# EAGLE design Trabalho_3 (EAGLE 9.6.2)
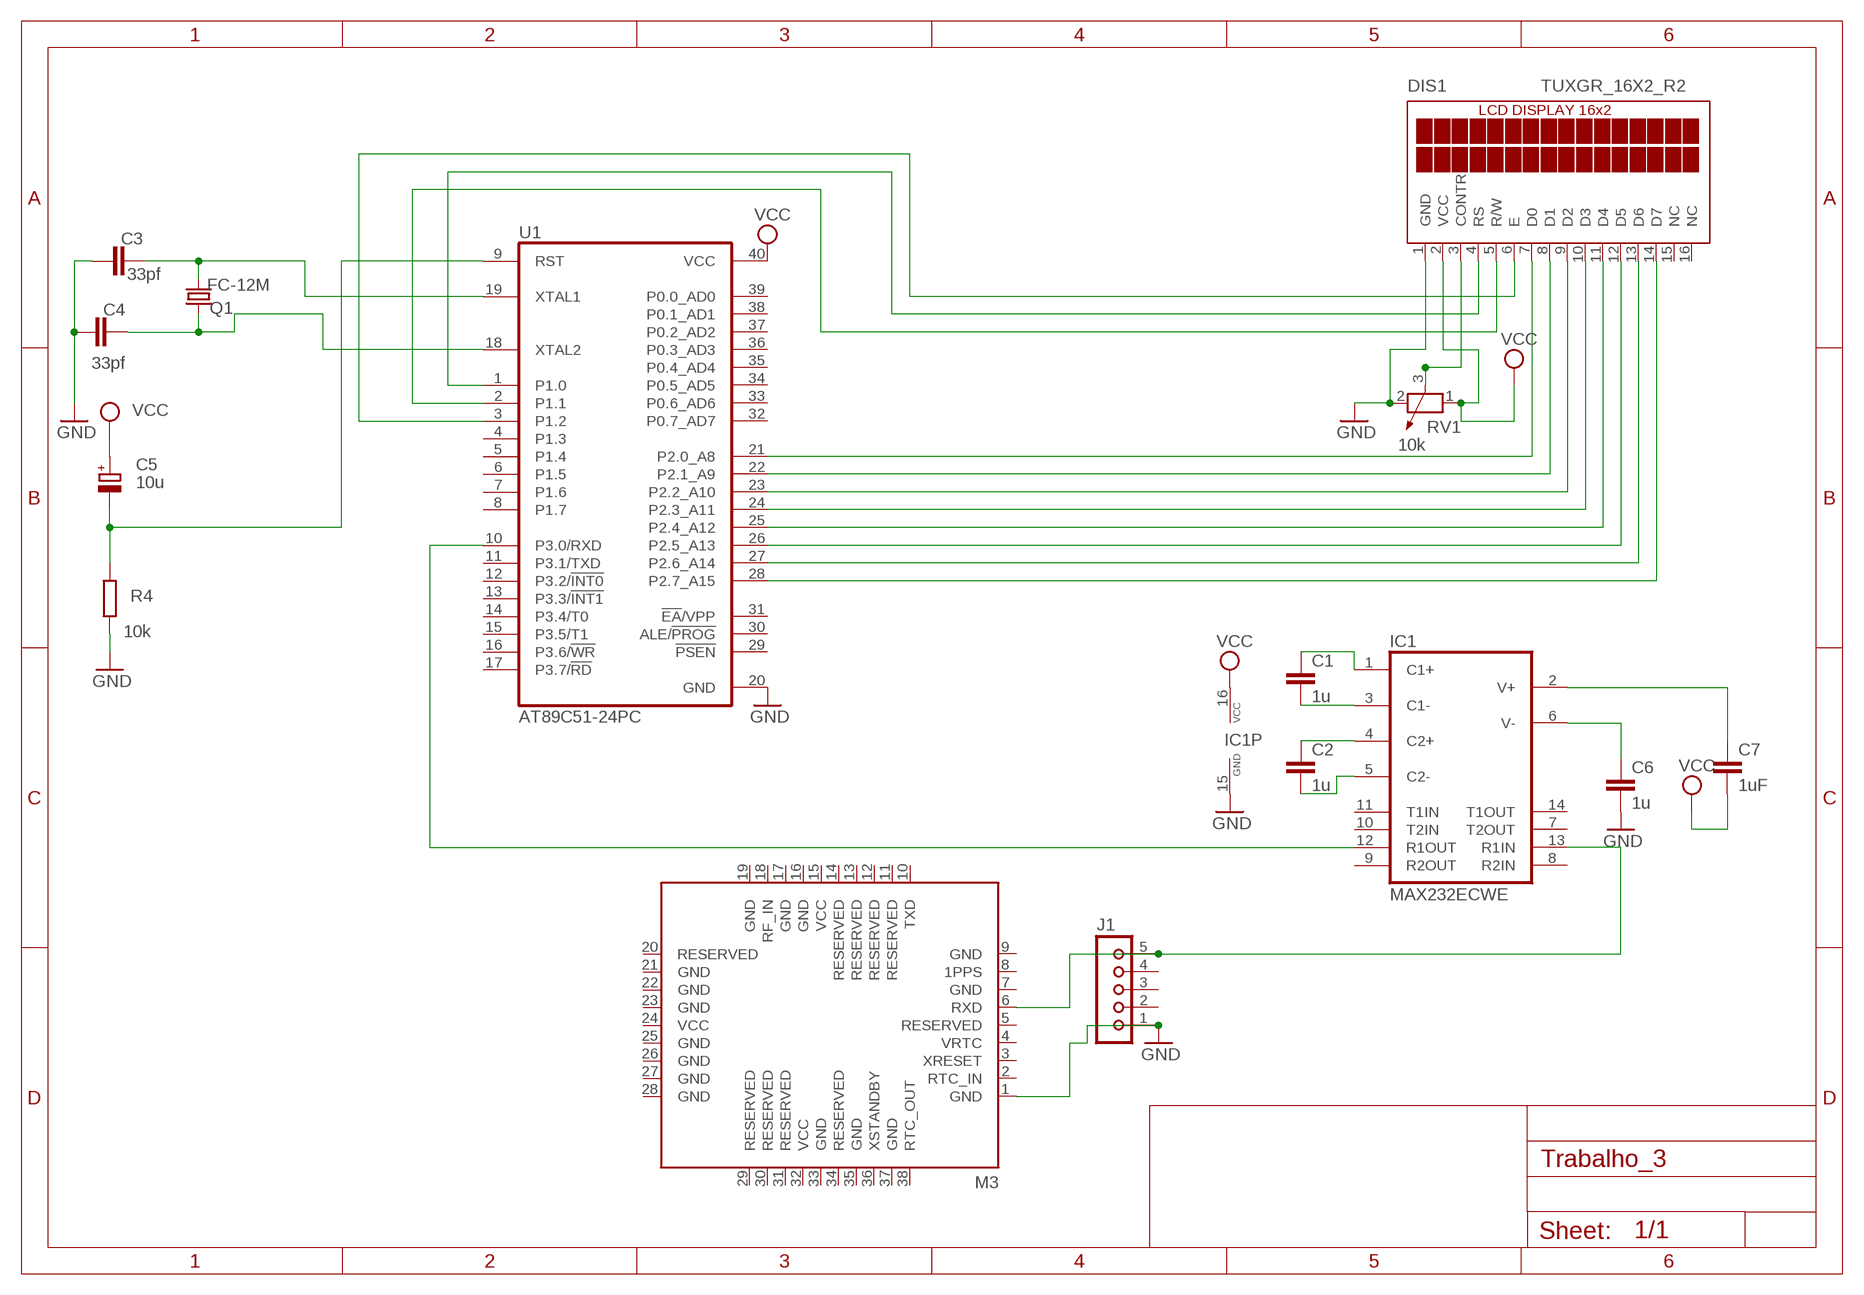
[diagram p0: schematic, sheet 1]

## Parts
C1  1u  C-EU025-025X050  [C025-025X050]
C2  1u  C-EU025-025X050  [C025-025X050]
C3  33pf  C-EU025-025X050  [C025-025X050]
C4  33pf  C-EU025-025X050  [C025-025X050]
C5  10u  CPOL-EUE2,5-6E  [E2,5-6E]
C6  1u  C-EUC0805  [C0805]
C7  1uF  C-EUC0805  [C0805]
DIS1  TUXGR_16X2_R2  [TUXGR_16X2_R2]
IC1  MAX232ECWE  [SO16L]
J1  JU05  [JU05]
M3  C1011_CONDOR-SMD  [1011]
Q1  FC-12M  [FC-12M]
R4  10k  R-EU_0204/7  [0204/7]
RV1  10k  POTENTIOMETER_PT-10  [PT-10]
U1  AT89C51-24PC  [DIL40]

## Nets
GND: C3.1 C4.1 C6.2 DIS1.1(GND) IC1.15(GND) J1.1 M3.1(GND) R4.1 RV1.2 U1.20(GND)
N$1: DIS1.3(CONTR) RV1.3
N$2: DIS1.4(RS) U1.1(P1.0)
N$3: DIS1.5(R/W) U1.2(P1.1)
N$4: DIS1.6(E) U1.3(P1.2)
N$5: DIS1.7(D0) U1.21(P2.0_A8)
N$6: DIS1.8(D1) U1.22(P2.1_A9)
N$7: DIS1.9(D2) U1.23(P2.2_A10)
N$8: DIS1.10(D3) U1.24(P2.3_A11)
N$9: DIS1.11(D4) U1.25(P2.4_A12)
N$10: DIS1.12(D5) U1.26(P2.5_A13)
N$11: DIS1.13(D6) U1.27(P2.6_A14)
N$12: DIS1.14(D7) U1.28(P2.7_A15)
N$13: C3.2 Q1.2 U1.19(XTAL1)
N$14: C5.- R4.2 U1.9(RST)
N$15: C4.2 Q1.1 U1.18(XTAL2)
N$16: IC1.12(R1OUT) U1.10(P3.0/RXD)
N$17: C1.1 IC1.1(C1+)
N$18: C1.2 IC1.3(C1-)
N$19: C2.1 IC1.4(C2+)
N$20: C2.2 IC1.5(C2-)
N$21: C6.1 IC1.6(V-)
N$22: C7.1 IC1.2(V+)
N$24: IC1.13(R1IN) J1.5 M3.6(RXD)
VCC: C5.+ C7.2 DIS1.2(VCC) IC1.16(VCC) RV1.1 U1.40(VCC)
Unconnected: DIS1.15(NC) DIS1.16(NC) IC1.7(T2OUT) IC1.8(R2IN) IC1.9(R2OUT) IC1.10(T2IN) IC1.11(T1IN) IC1.14(T1OUT) J1.2 J1.3 J1.4 M3.2(RTC_IN) M3.3(XRESET) M3.4(VRTC) M3.5(RESERVED) M3.8(1PPS) M3.10(TXD) M3.11(RESERVED) M3.12(RESERVED) M3.13(RESERVED) M3.14(RESERVED) M3.18(RF_IN) M3.20(RESERVED) M3.29(RESERVED) M3.30(RESERVED) M3.31(RESERVED) M3.34(RESERVED) M3.36(XSTANDBY) M3.38(RTC_OUT) U1.4(P1.3) U1.5(P1.4) U1.6(P1.5) U1.7(P1.6) U1.8(P1.7) U1.11(P3.1/TXD) U1.12(P3.2/!INT0) U1.13(P3.3/!INT1) U1.14(P3.4/T0) U1.15(P3.5/T1) U1.16(P3.6/!WR) U1.17(P3.7/!RD) U1.29(!PSEN) U1.30(ALE/!PROG) U1.31(!EA!/VPP) U1.32(P0.7_AD7) U1.33(P0.6_AD6) U1.34(P0.5_AD5) U1.35(P0.4_AD4) U1.36(P0.3_AD3) U1.37(P0.2_AD2) U1.38(P0.1_AD1) U1.39(P0.0_AD0)

## Power pins joined to a net without a drawn wire
GND: M3.7(GND) M3.9(GND) M3.16(GND) M3.17(GND) M3.19(GND) M3.21(GND) M3.22(GND) M3.23(GND) M3.25(GND) M3.26(GND) M3.27(GND) M3.28(GND) M3.33(GND) M3.35(GND) M3.37(GND)
VCC: M3.15(VCC) M3.24(VCC) M3.32(VCC)

## Library data of the parts
C1-C4 C6 C7 = rcl:C-EU: CAPACITOR, European symbol; SPICEPREFIX: C
C5 = rcl:CPOL-EU: POLARIZED CAPACITOR, European symbol; SPICEPREFIX: C
DIS1 = display-lcd:TUXGR_16X2_R2: Tuxgraphics LCD display 16x2 characters reflective, without background light Source: tuxgr_12x2_r2.pdf; OC_FARNELL: unknown; OC_NEWARK: unknown
IC1 = maxim:MAX232ECWE: RS232 TRANSCEIVER; MF: MAXIM; MPN: MAX232ECWE+; OC_FARNELL: 9724435; OC_NEWARK: 67K4440
J1 = con-lsta:JU05: PIN HEADER; OC_FARNELL: unknown; OC_NEWARK: unknown
M3 = trimble:C1011_CONDOR: Condor C1011 GPS Receiver Module SMD GPS Receiver module, made by Trimble Navigation Ltd, Embedded Systems Group <http://www.trimble.com/embeddedsystems/> Partnumber: 68674-00 Datasheet, User Manual and Tools <http://www.trimble.com/embeddedsystems/condor-gps-module.aspx> Created by Trimble Navigation Ltd, Author: Christian Voit <mailto:christian_voit@trimble.com?subject=Trimble Eagle Library>
Q1 = crystal:FC-12M: kHz RANGE CRYSTAL UNIT LOW PROFILE SMD Source: Epson Toyocom FC-12M.pdf
R4 = rcl:R-EU_: RESISTOR, European symbol; SPICEPREFIX: R
RV1 = rcl:POTENTIOMETER_: Potentiometer; SPICEMODEL: POT; SPICEPREFIX: X
U1 = atmel:AT89C51-*: 8-bit Microcontroller with 4K Bytes Flash Not Recommended for New Designs. Use AT89S51. Source: http://www.atmel.com/dyn/resources/prod_documents/doc0265.; OC_FARNELL: unknown; OC_NEWARK: unknown

## Board
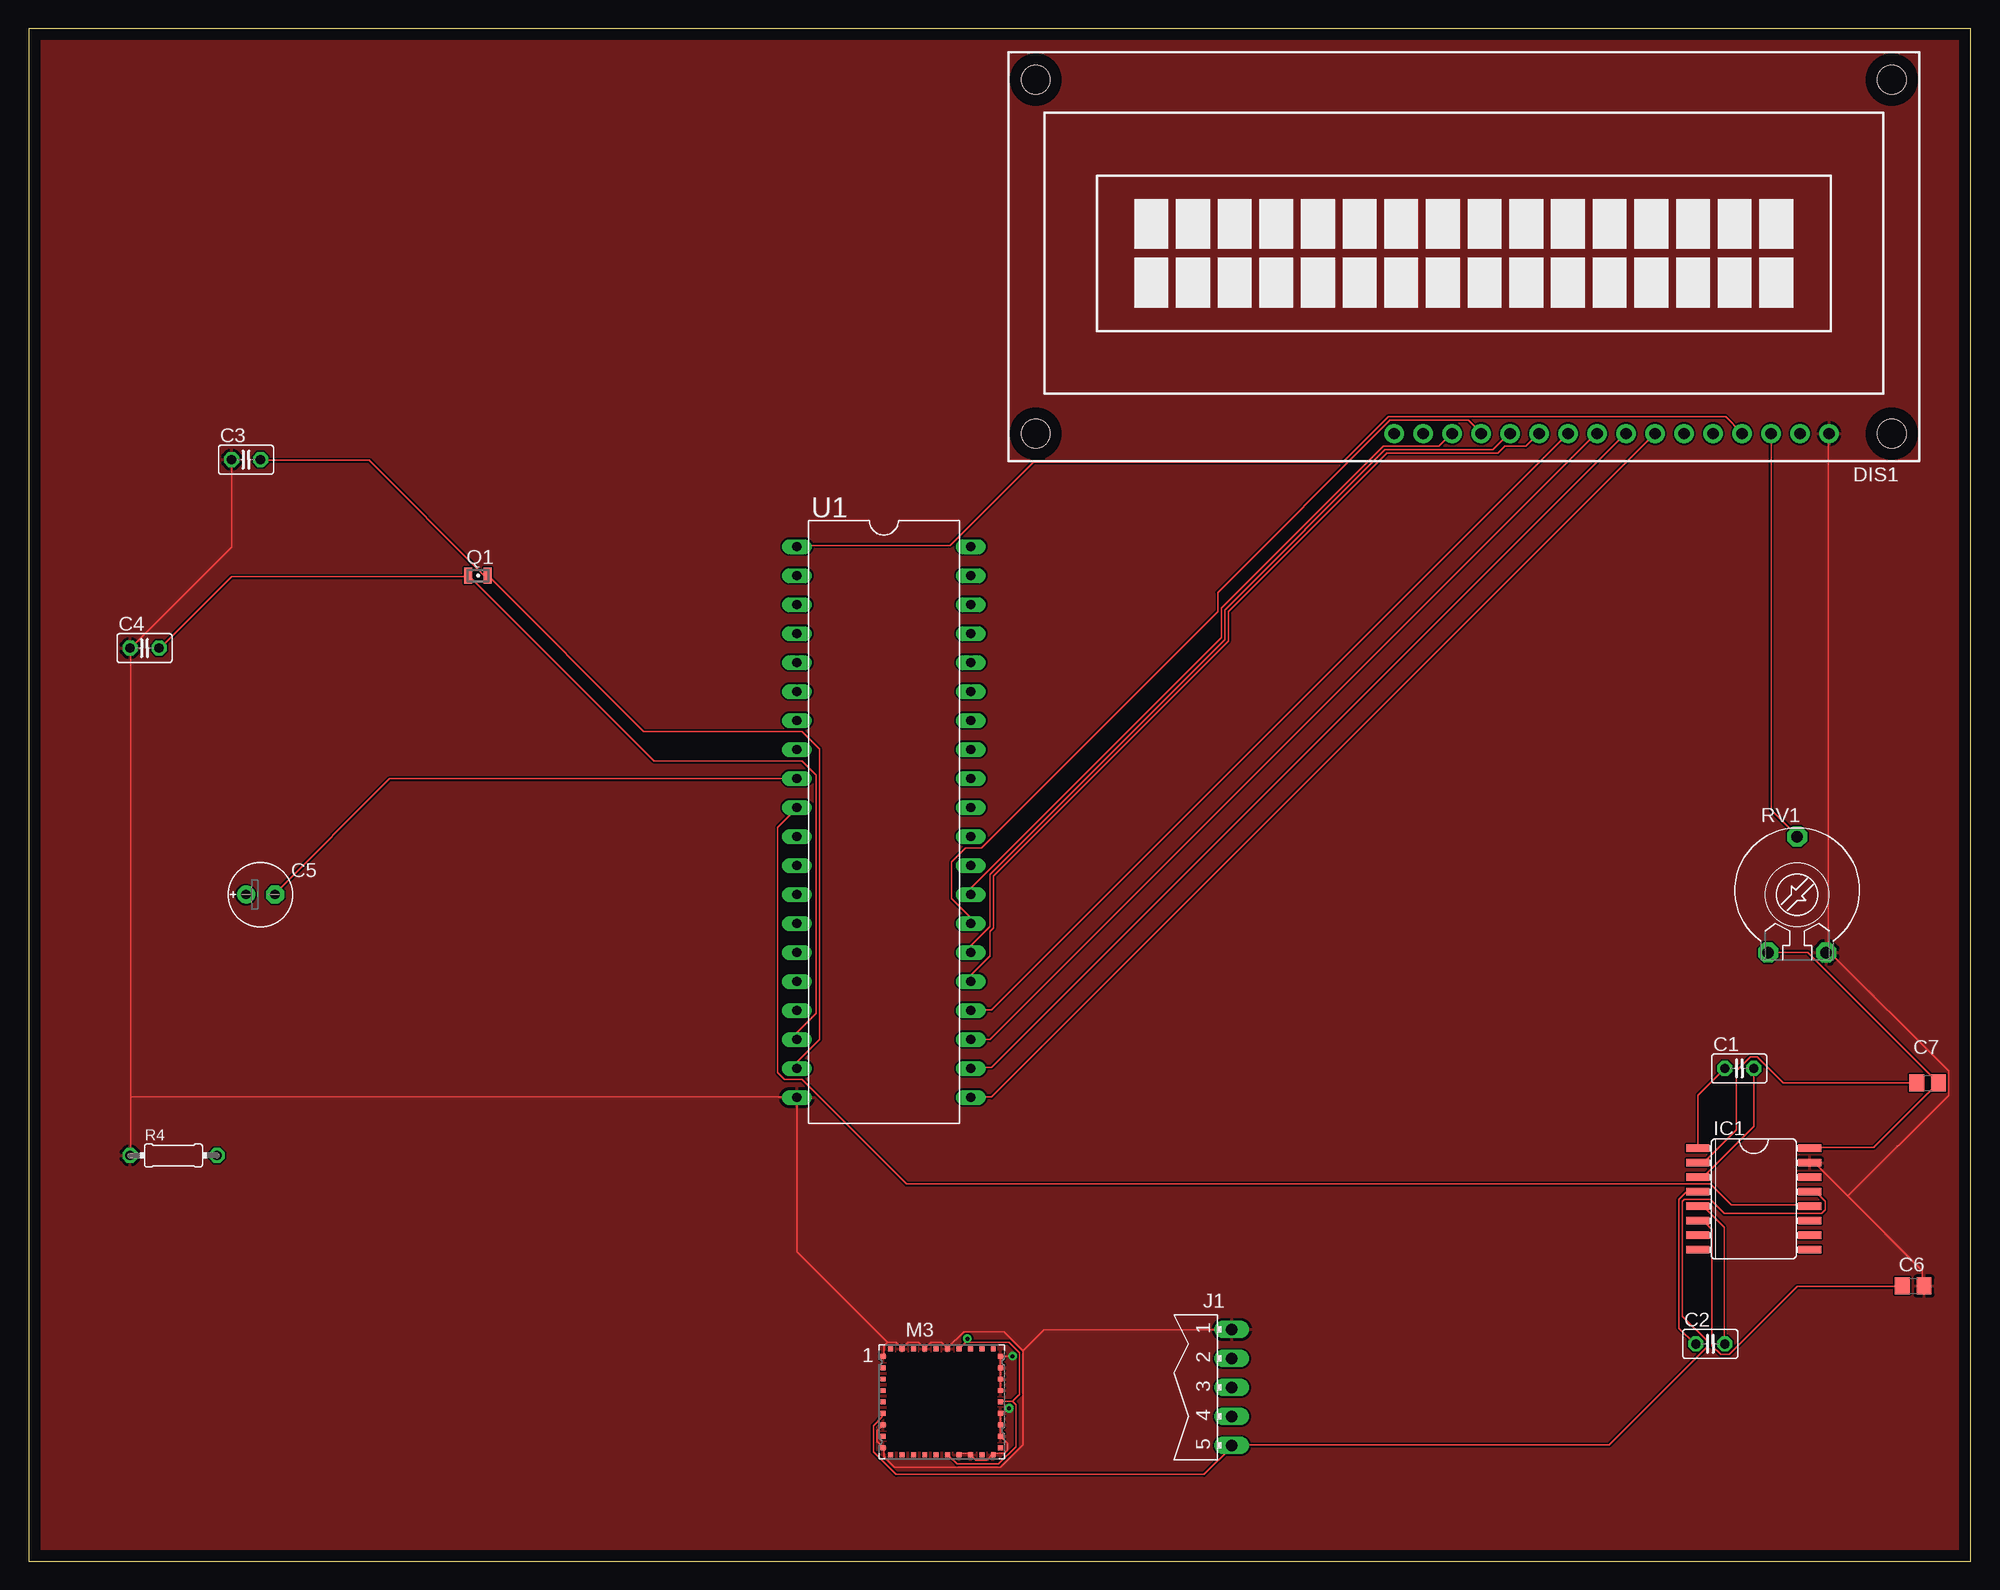
[diagram p1: board, top side]
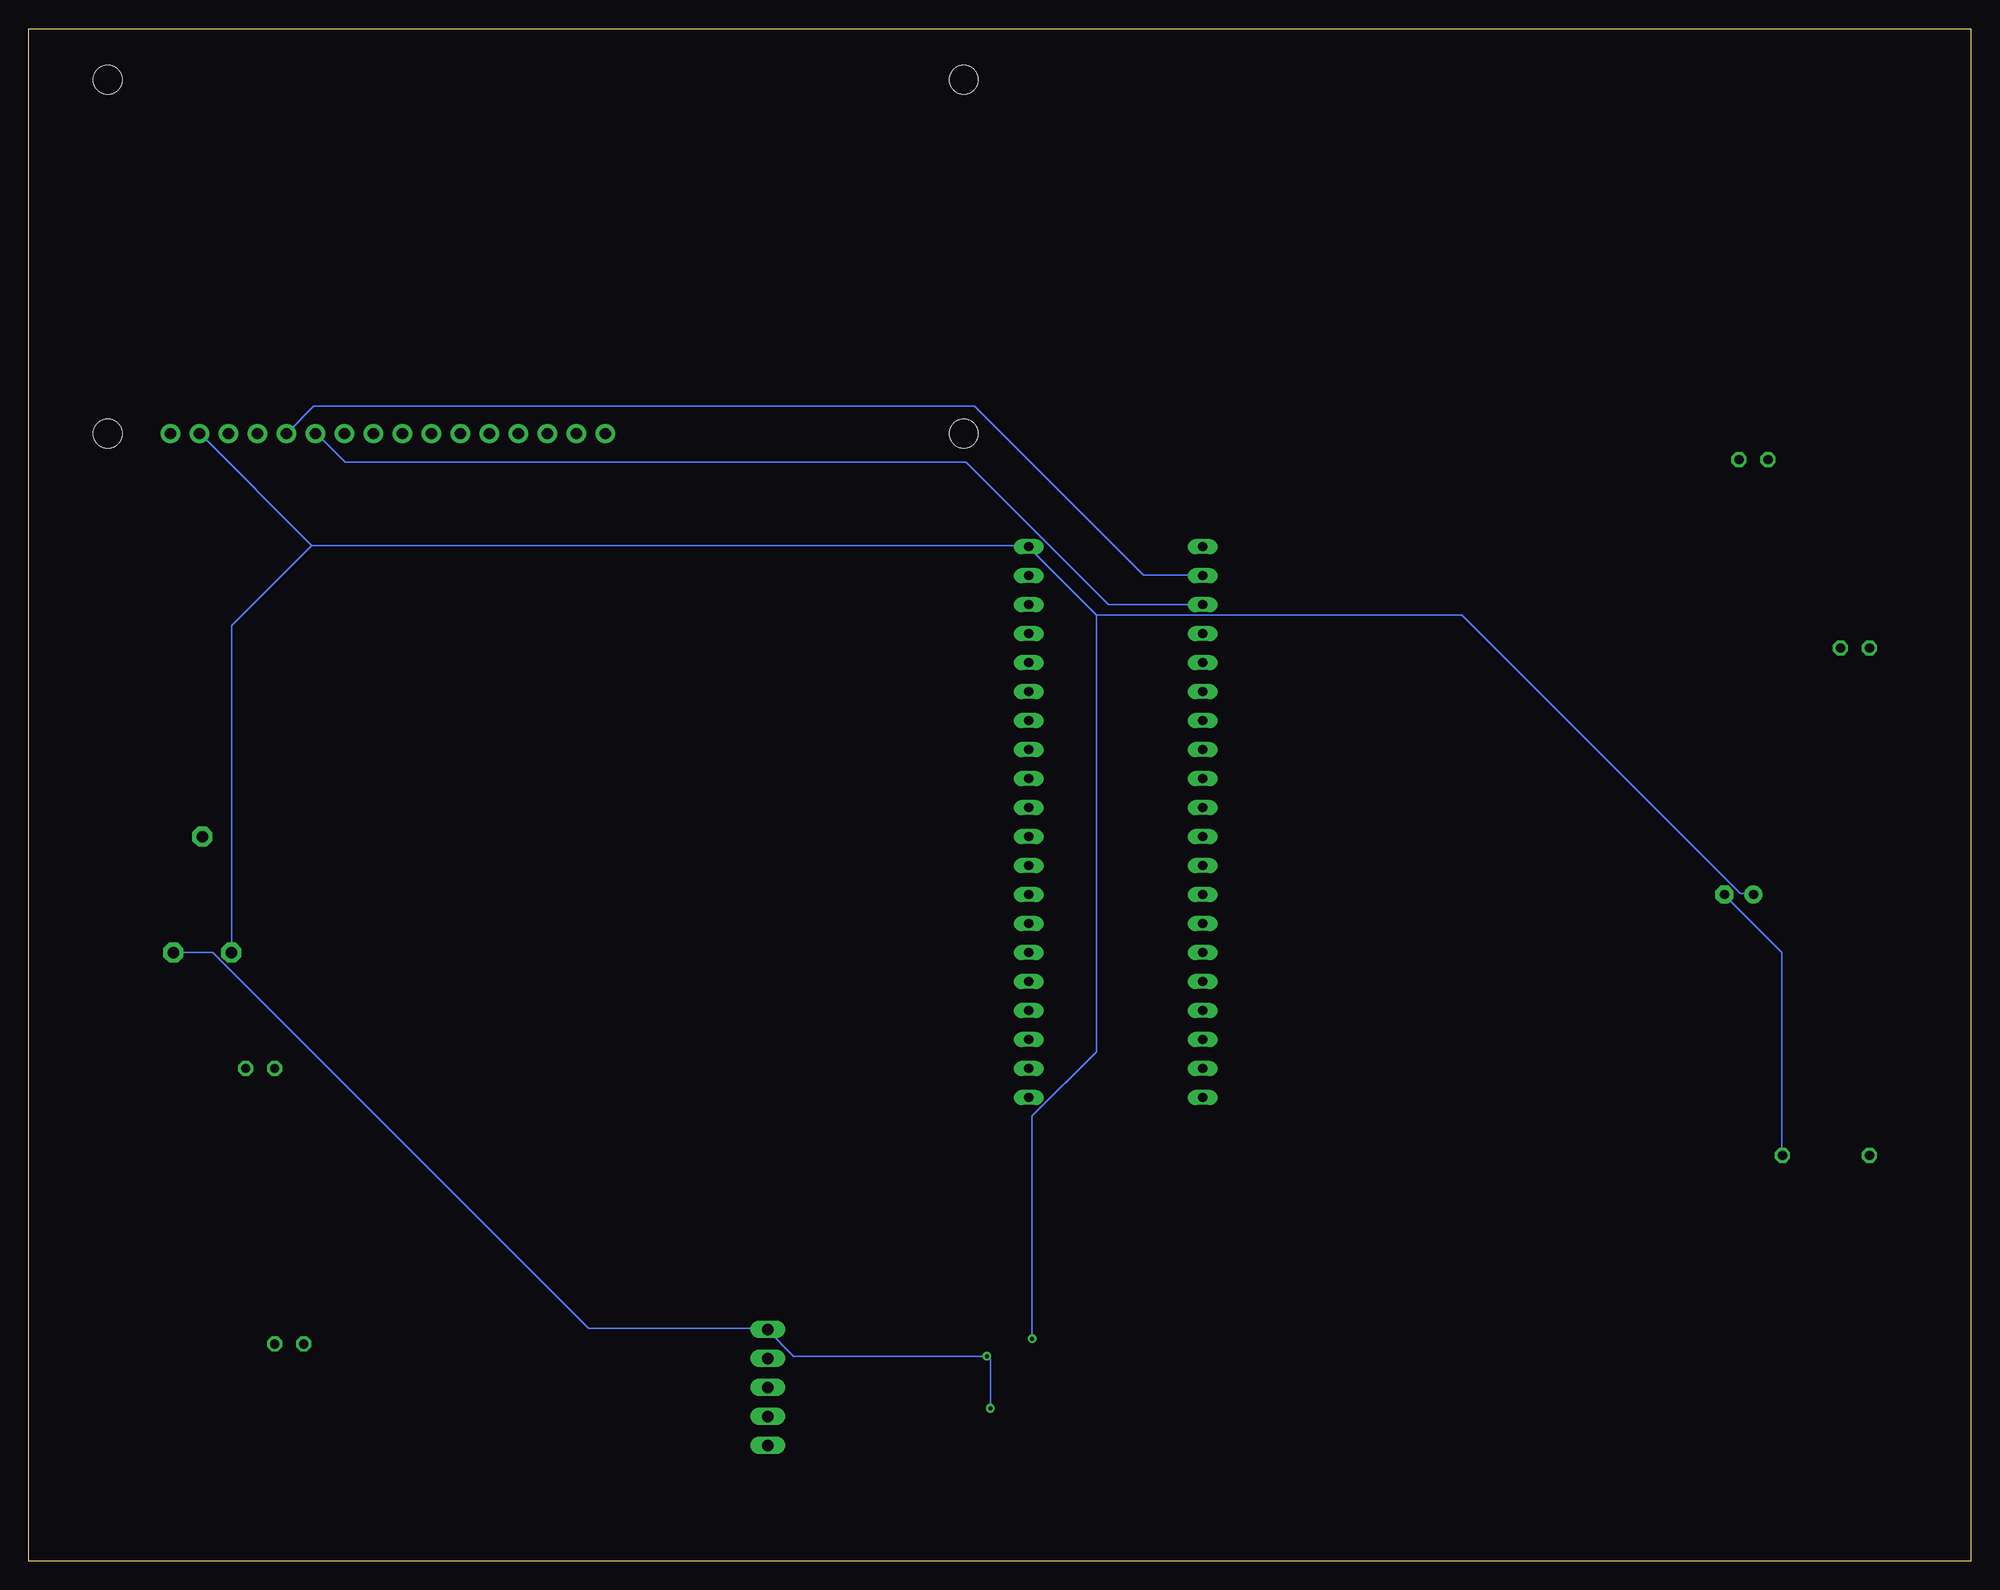
[diagram p2: board, bottom side, seen from below]

Size 170.16 x 134.29 mm. Coordinates in mm from the lower left corner, seen from the top.
Outline: 0,0 170.16,0 170.16,134.29 0,134.29 0,0
Copper layers (1*16): Top 0.035mm / dielectric 1.5mm / Bottom 0.035mm
Design rules "default": minimum track width 6mil, minimum drill 0.35mm, track to track 6mil, track to pad 6mil, pad to pad 6mil, via to via 6mil, smd to smd 6mil, copper to edge 40mil, drill to drill 6mil, minimum pad ring 10mil, minimum via ring 8mil, stop-mask expansion 4mil, vias tented up to drill 0mil, thermal gap 10mil

### Footprints (pad centres in the part's own frame; a part is rotated, then mirrored left to right if it is on the bottom)
C025-025X050 = drill 0.813 octagon: 1 -1.27,0; 2 1.27,0
E2,5-6E = drill 0.813 pad 1.575: + -1.27,0 | drill 0.813 pad 1.575 octagon: - 1.27,0
C0805 = smd 1.3 x 1.5: 1 -0.95,0; 2 0.95,0
TUXGR_16X2_R2 = drill 1 pad 1.676: 1 -32,15.5; 2 -29.46,15.5; 3 -26.92,15.5; 4 -24.38,15.5; 5 -21.84,15.5; 6 -19.3,15.5; 7 -16.76,15.5; 8 -14.22,15.5; 9 -11.68,15.5; 10 -9.14,15.5; 11 -6.6,15.5; 12 -4.06,15.5; 13 -1.52,15.5; 14 1.02,15.5; 15 3.56,15.5; 16 6.1,15.5 | hole 2.5: -37.5,-15.5; 37.5,-15.5; -37.5,15.5; 37.5,15.5
SO16L = smd 0.66 x 2.032: 1 -4.445,-4.902; 2 -3.175,-4.902; 3 -1.905,-4.902; 4 -0.635,-4.902; 5 0.635,-4.902; 6 1.905,-4.902; 7 3.175,-4.902; 8 4.445,-4.902; 9 4.445,4.902; 10 3.175,4.902; 11 1.905,4.902; 12 0.635,4.902; 13 -0.635,4.902; 14 -1.905,4.902; 15 -3.175,4.902; 16 -4.445,4.902
JU05 = drill 1.016 long: 1 -5.08,0; 2 -2.54,0; 3 0,0; 4 2.54,0; 5 5.08,0
1011 = smd 0.43 x 0.43: 1 -5.145,4; 2 -5.145,3; 3 -5.145,2; 4 -5.145,1; 5 -5.145,0; 6 -5.145,-1; 7 -5.145,-2; 8 -5.145,-3; 9 -5.145,-4; 10 -4.5,-4.645; 11 -3.5,-4.645; 12 -2.5,-4.645; 13 -1.5,-4.645; 14 -0.5,-4.645; 15 0.5,-4.645; 16 1.5,-4.645; 17 2.5,-4.645; 18 3.5,-4.645; 19 4.5,-4.645; 20 5.145,-4; 21 5.145,-3; 22 5.145,-2; 23 5.145,-1; 24 5.145,0; 25 5.145,1; 26 5.145,2; 27 5.145,3; 28 5.145,4; 29 4.5,4.645; 30 3.5,4.645; 31 2.5,4.645; 32 1.5,4.645; 33 0.5,4.645; 34 -0.5,4.645; 35 -1.5,4.645; 36 -2.5,4.645; 37 -3.5,4.645; 38 -4.5,4.645
FC-12M = smd 0.7 x 1.4: 1 -0.85,0; 2 0.85,0
0204/7 = drill 0.813 octagon: 1 -3.81,0; 2 3.81,0
PT-10 = drill 1.016 pad 1.778 octagon: 1 -2.54,-5.08; 2 2.54,-5.08; 3 0,5.08
DIL40 = drill 0.813 long: 1 -24.13,-7.62; 2 -21.59,-7.62; 3 -19.05,-7.62; 4 -16.51,-7.62; 5 -13.97,-7.62; 6 -11.43,-7.62; 7 -8.89,-7.62; 8 -6.35,-7.62; 9 -3.81,-7.62; 10 -1.27,-7.62; 11 1.27,-7.62; 12 3.81,-7.62; 13 6.35,-7.62; 14 8.89,-7.62; 15 11.43,-7.62; 16 13.97,-7.62; 17 16.51,-7.62; 18 19.05,-7.62; 19 21.59,-7.62; 20 24.13,-7.62; 21 24.13,7.62; 22 21.59,7.62; 23 19.05,7.62; 24 16.51,7.62; 25 13.97,7.62; 26 11.43,7.62; 27 8.89,7.62; 28 6.35,7.62; 29 3.81,7.62; 30 1.27,7.62; 31 -1.27,7.62; 32 -3.81,7.62; 33 -6.35,7.62; 34 -8.89,7.62; 35 -11.43,7.62; 36 -13.97,7.62; 37 -16.51,7.62; 38 -19.05,7.62; 39 -21.59,7.62; 40 -24.13,7.62

### Placement (x,y rotation side)
C1  149.86,43.18 0 top
C2  147.32,19.05 0 top
C3  19.05,96.52 0 top
C4  10.16,80.01 0 top
C5  20.32,58.42 0 top
C6  165.1,24.13 0 top
C7  166.37,41.91 0 top
DIS1  125.73,114.3 180 top
IC1  151.13,31.75 270 top
J1  105.41,15.24 270 top
M3  80.01,13.97 0 top
Q1  39.37,86.36 0 top
R4  12.7,35.56 0 top
RV1  154.94,58.42 0 top
U1  74.93,64.77 270 top

### Tracks (layer width: path | path; a pad name or v marks a point on that pad's centre or on a via)
GND  (via drill 0.35)
  Top 0.152: 159.36,32 156.46,34.9 156.16,34.9 IC1.15 | 159.36,32 165.91,25.45 165.91,24.23 C6.2 | 157.68,53.49 157.68,98.75 DIS1.1 | 157.68,53.49 157.53,53.34 RV1.2 157.68,53.49 | 159.36,32 168.2,40.84 168.2,42.98 157.68,53.49 | M3.16 81.64,9.45 82.4,9.45 M3.17 82.55,9.3 83.01,8.84 83.92,8.84 84.38,9.3 M3.19 84.53,9.45 85.45,9.45 85.75,9.75 85.75,10.36 85.29,10.82 M3.21 85.14,11.89 M3.22 85.14,12.04 85.14,12.95 M3.23 85.29,13.11 85.6,13.11 v85.9,13.41 | M3.25 85.14,15.09 85.14,15.85 M3.26 85.14,16 85.14,16.92 M3.27 85.14,17.07 85.14,17.83 M3.28 85.29,17.98 v86.21,17.98 | 75.23,19.2 74.93,18.9 74.93,17.98 M3.1 | 75.23,19.2 76,19.2 76.45,18.75 M3.37 76.61,18.75 77.06,19.2 77.98,19.2 78.44,18.75 M3.35 78.59,18.75 79.05,19.2 79.96,19.2 80.42,18.75 M3.33 80.57,18.75 81.94,20.12 85.45,20.12 87.12,18.44 | M3.7 74.78,11.89 74.32,11.43 74.32,10.52 74.78,10.06 M3.9 74.93,9.91 74.93,9.14 75.84,8.23 85.14,8.23 87.12,10.21 87.12,18.44 | 75.23,19.2 67.31,27.13 U1.20 67.31,40.69 8.94,40.69 | 87.12,18.44 88.95,20.27 105.41,20.27 J1.1 | 8.94,80.01 8.94,40.69 | 8.94,40.69 8.94,35.66 R4.1 | C3.1 17.78,88.85 8.94,80.01 | 8.94,80.01 C4.1
  Bottom 0.152: v85.9,13.41 85.9,17.68 v86.21,17.98 103.12,17.98 105.41,20.27 J1.1 105.41,20.42 121.11,20.42 154.03,53.34 RV1.2
  pour Top: 0,134.62 0,0 170.18,0 170.18,134.62
N$1
  Top 0.152: DIS1.3 152.65,98.75 152.65,65.84 154.94,63.55 RV1.3
N$2
  Top 0.152: U1.1 67.31,89 80.72,89 88.04,96.32 115.16,96.32 119.13,100.28 148.69,100.28 150.06,98.91 DIS1.4
N$3
  Bottom 0.152: U1.2 67.31,86.41 72.49,86.41 87.27,101.19 145.19,101.19 147.47,98.91 DIS1.5
N$4
  Bottom 0.152: U1.3 75.54,83.82 88.04,96.32 142.44,96.32 144.88,98.75 DIS1.6
N$5
  Top 0.152: U1.21 82.55,40.69 84.38,40.69 142.44,98.75 DIS1.7
N$6
  Top 0.152: U1.22 82.55,43.28 84.38,43.28 139.85,98.75 DIS1.8
N$7
  Top 0.152: U1.23 84.23,45.72 137.26,98.75 DIS1.9
N$8
  Top 0.152: U1.24 82.55,48.31 84.38,48.31 134.82,98.75 DIS1.10
N$9
  Top 0.152: U1.25 82.55,51.36 84.23,53.03 84.23,55.17 84.53,55.47 84.53,60.05 105.1,80.62 105.1,83.21 118.97,97.08 128.73,97.08 129.34,97.69 131.17,97.69 132.23,98.75 DIS1.11
N$10
  Top 0.152: U1.26 82.55,53.95 84.23,55.63 84.23,60.2 104.8,80.77 104.8,83.36 118.82,97.38 128.27,97.38 129.64,98.75 DIS1.12
N$11
  Top 0.152: U1.27 82.55,56.39 80.87,58.06 80.87,61.27 82.09,62.48 83.46,62.48 104.19,83.21 104.19,84.89 119.28,99.97 126.14,99.97 127.2,98.91 DIS1.13
N$12
  Top 0.152: U1.28 82.55,58.98 104.5,80.92 104.5,83.52 118.67,97.69 123.55,97.69 124.61,98.75 DIS1.14
N$13
  Top 0.152: C3.2 20.37,96.47 29.82,96.47 39.88,86.41 40.18,86.41 Q1.2 40.34,86.26 53.9,72.69 67.77,72.69 69.29,71.17 69.29,45.72 67.31,43.74 U1.19
N$14
  Top 0.152: U1.9 31.65,68.58 21.59,58.52 C5.-
  Bottom 0.152: R4.2 16.56,35.66 16.56,53.34 21.59,58.37 C5.-
N$15
  Top 0.152: C4.2 11.53,80.01 17.78,86.26 38.51,86.26 Q1.1 38.66,86.26 54.81,70.1 67.77,70.1 68.99,68.89 68.99,48.01 67.31,46.33 U1.18
N$16
  Top 0.152: IC1.12 156.01,31.24 149.15,31.24 147.32,33.07 76.91,33.07 67.77,42.22 66.24,42.22 65.63,42.82 65.63,64.31 67.31,65.99 U1.10
N$17
  Top 0.152: C1.1 146.25,40.84 146.25,36.27 IC1.1
N$18
  Top 0.152: C1.2 151.13,38.1 146.71,33.68 146.25,33.68 IC1.3
N$19
  Top 0.152: IC1.4 146.1,32.31 145.19,32.31 144.58,31.7 144.58,20.42 145.95,19.05 C2.1
N$20
  Top 0.152: IC1.5 146.25,31.09 146.71,31.09 148.54,29.26 148.54,19.05 C2.2
N$21
  Top 0.152: C6.1 164.08,24.08 154.94,24.08 149,18.14 148.23,18.14 147.47,18.9 147.47,29.11 146.86,29.72 146.25,29.72 IC1.6
N$22
  Top 0.152: C7.1 153.72,41.91 151.44,44.2 150.82,44.2 149.61,42.98 149.61,37.8 146.86,35.05 146.25,35.05 IC1.2
N$24
  Top 0.152: M3.6 74.78,12.95 74.78,12.65 74.02,11.89 74.02,9.6 76,7.62 102.97,7.62 105.41,10.06 J1.5 105.41,10.21 138.48,10.21 147.01,18.75 147.01,19.36 144.88,21.49 144.88,31.55 145.03,31.7 147.32,31.7 148.54,30.48 157.07,30.48 157.38,30.79 157.38,31.55 156.62,32.31 156.16,32.31 IC1.13
VCC  (via drill 0.35)
  Top 0.152: 167.28,41.91 161.65,36.27 156.16,36.27 IC1.16 | RV1.1 155.85,53.34 167.28,41.91 | 167.28,41.91 C7.2 | 86.21,14.02 86.51,13.72 86.51,10.06 84.99,8.53 81.33,8.53 80.57,9.3 M3.15 | 86.21,14.02 85.29,14.02 M3.24 | 82.24,19.2 85.9,19.2 86.82,18.29 86.82,14.63 86.21,14.02 | 82.24,19.2 82.09,19.2 81.64,18.75 M3.32 | v82.24,19.51 82.24,19.2
  Bottom 0.152: 145.34,89 82.55,89 U1.40 82.55,88.85 76.61,82.91 | 145.34,89 155.09,98.75 DIS1.2 | 76.61,82.91 44.6,82.91 20.22,58.52 19.15,58.52 C5.+ | v82.24,19.51 82.24,39.01 76.61,44.65 76.61,82.91 | 145.34,89 152.35,81.99 152.35,53.34 RV1.1